# Altium schematic sheet TC_IC1.SchDoc
size A4; SheetNumber: 4; SheetTotal: 11
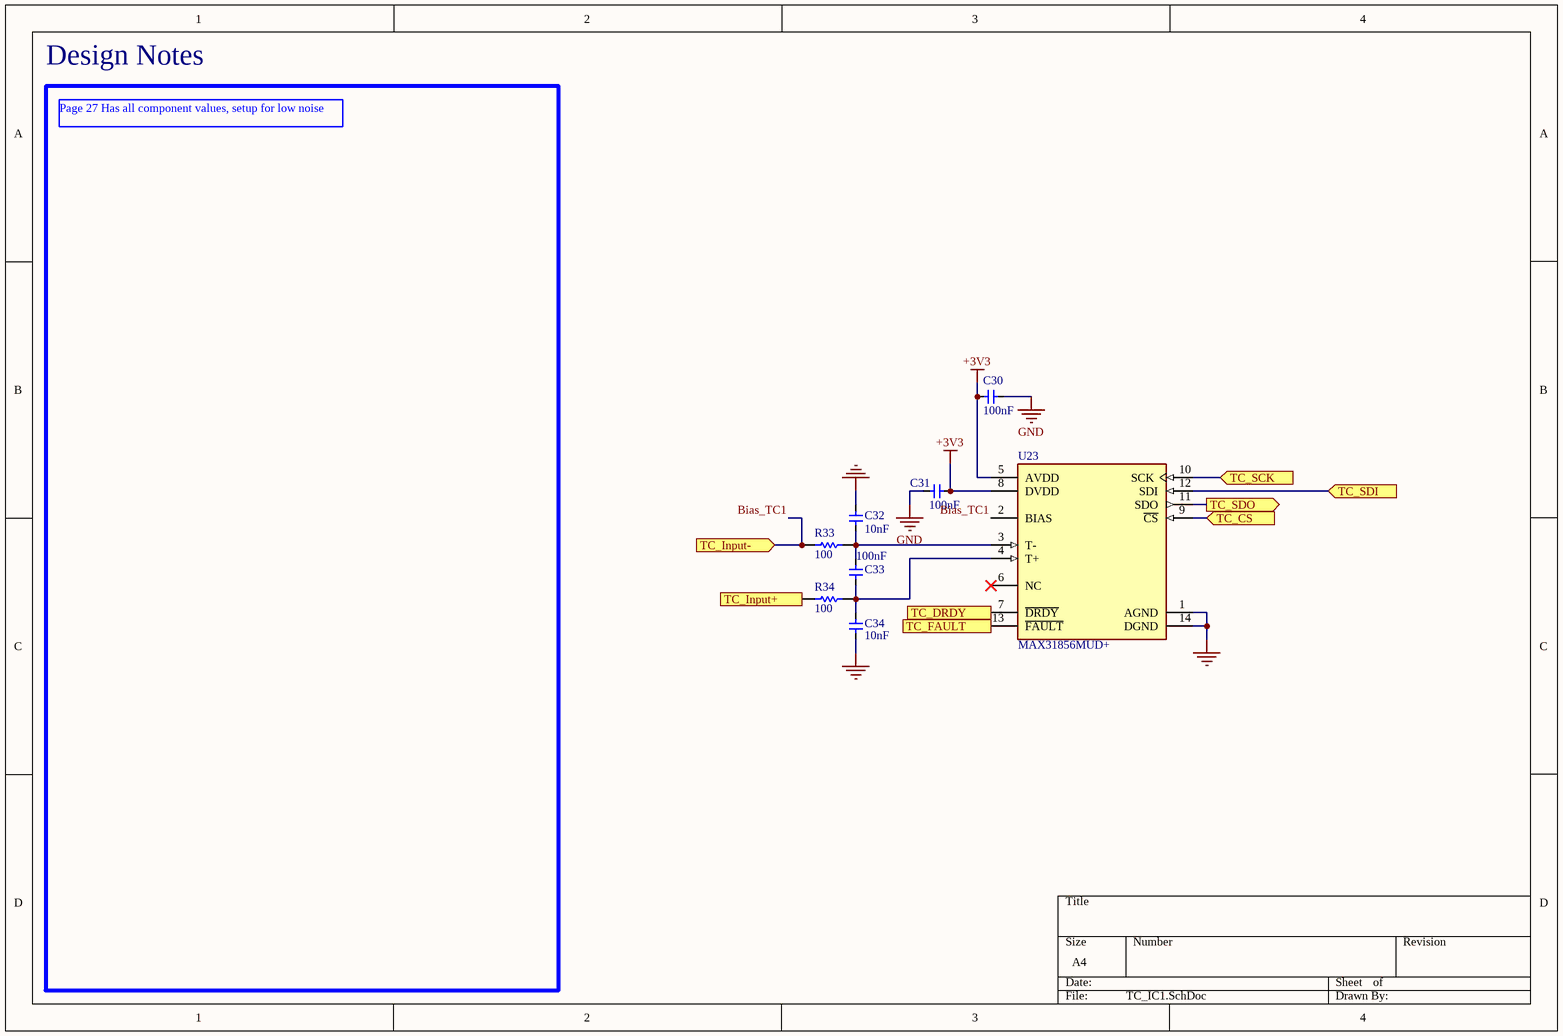
[diagram p0: TC_IC1.SchDoc]

## Parts
C30  value 100nF  [0.1uF-FP-CGA3E-0_3-0_1-IPC_A]  (hidden comment: CAP CER 0.1UF 25V 0603)
C31  value 100nF  [0.1uF-FP-CGA3E-0_3-0_1-IPC_A]  (hidden comment: CAP CER 0.1UF 25V 0603)
C32  value 10nF  [10000pF-CAP_1608_TDK]  (hidden comment: CGA3E2X7R1H103K080AA)
C33  value 100nF  [0.1uF-FP-CGA3E-0_3-0_1-IPC_A]  (hidden comment: CAP CER 0.1UF 25V 0603)
C34  value 10nF  [10000pF-CAP_1608_TDK]  (hidden comment: CGA3E2X7R1H103K080AA)
R33  value 100  [RESC1608X55X30LL15T15]  (hidden comment: ERJ-3EKF1000V)
R34  value 100  [RESC1608X55X30LL15T15]  (hidden comment: ERJ-3EKF1000V)
U23  MAX31856MUD+  [FP-U14-2-MFG]

## Ports
TC_CS (in, see TopLevel[2A]), TC_DRDY (out, see TopLevel[3A]), TC_FAULT (out, see TopLevel[3A]), TC_Input+ (in, see TopLevel[2A]), TC_Input- (in, see TopLevel[2A]), TC_SCK (in, see TopLevel[2A], TC_IC2[4B], TC_IC3[4B]), TC_SDI (in, see TopLevel[2A], TC_IC2[4B], TC_IC3[4B]), TC_SDO (out, see TopLevel[3A], TC_IC2[4B], TC_IC3[4B])

## Nets
+3V3: C30.1 C31.1 U23.5(AVDD) U23.8(DVDD)
GND: C30.2 C31.2 C32.1 C34.1 U23.1(AGND) U23.14(DGND)
Bias_TC1: R33.2 U23.2(BIAS) ; port TC_Input-
TC_CS: U23.9(~{CS}) ; port TC_CS
TC_DRDY: U23.7(~{DRDY}) ; port TC_DRDY
TC_FAULT: U23.13(~{FAULT}) ; port TC_FAULT
TC_Input+: R34.2 ; port TC_Input+
TC_SCK: U23.10(SCK) ; port TC_SCK
TC_SDI: U23.12(SDI) ; port TC_SDI
TC_SDO: U23.11(SDO) ; port TC_SDO
NetC32_2: C32.2 C33.2 R33.1 U23.3(T-)
NetC33_1: C33.1 C34.2 R34.1 U23.4(T+)

Not connected (* = marked no-connect by the designer): U23 6(NC)*

## Notes on the sheet
- Design Notes
- Page 27 Has all component values, setup for low noise

## Library data of the parts
C30 C31 C33 = CMP-001-00093-3: CGA3E2X7R1E104K080AA CAP CER 0.1UF 25V X7R 0603; Manufacturer: TDK Corporation; Tolerance: 10%; Voltage - Rated: 25V; Design Item ID: CGA3E2X7R1E104K080AA; ComponentLink1URL: https://product.tdk.com/info/en/catalog/spec/mlccspec_automotive_general_en.pdf; Thickness (Max): 0.035" (0.90mm); Operating Temperature: -55°C ~ 125°C; Mounting Type: Surface Mount, MLCC; Source: PlumBay_SchLib.SchLib; Size / Dimension: 0.063" L x 0.031" W (1.60mm x 0.80mm); Case/Package: 0603 (1608 Metric); ComponentLink1Description: Datasheet; Temperature Coefficient: X7R; Manufacturer Part Number: CGA3E2X7R1E104K080AA
C32 C34 = CMP-001-00094-1: CAP CER 10000PF 50V X7R 0603; Manufacturer: TDK Corporation; Tolerance: 10%; Voltage - Rated: 50V; Thickness (Max): 0.035" (0.90mm); ComponentLink1Description: Datasheet; Temperature Coefficient: X7R; Source: PlumBay_SchLib.SchLib; Operating Temperature: -55°C ~ 125°C; Case/Package: 0603 (1608 Metric); Mounting Type: Surface Mount, MLCC; Design Item ID: CGA3E2X7R1H103K080AA; Size / Dimension: 0.063" L x 0.031" W (1.60mm x 0.80mm); Manufacturer Part Number: CGA3E2X7R1H103K080AA; ComponentLink1URL: https://product.tdk.com/info/en/catalog/spec/mlccspec_automotive_general_en.pdf
R33 R34 = CMP-009-00194-1: Fixed Resistor, Metal Glaze/thick Film, 0.1W, 100ohm, 75V, 1% +/-Tol, 100ppm/Cel, Surface Mount, 0603; Power: 100mW; Pins: 2; Tolerance: 1%; RoHS Compliant: Yes; Case/Package: 0603; Min Operating Temperature: -55°C; Max Operating Temperature: 155°C; Mounting Technology: Surface Mount
U23 = CMP-015-00011-1: Analog Circuit, 1 Func, PDSO14; Max Supply Voltage: 3.6V; Min Supply Voltage: 3V; Nominal Supply Voltage: 3.3V; Pins: 14; Min Operating Temperature: -55°C; Case/Package: TSSOP; RoHS Compliant: Yes; Max Operating Temperature: 125°C